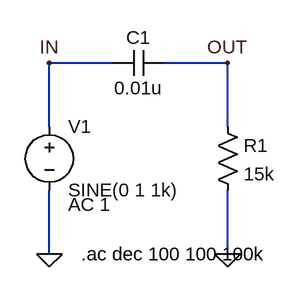
[diagram p0: schematic 2-1-2_RC_HPF.asc]
2-1-2_RC_HPF.asc, the LTspice schematic file:
Version 4.1
SHEET 1 880 680
WIRE 176 48 96 48
WIRE 320 48 240 48
WIRE 96 128 96 48
WIRE 320 128 320 48
WIRE 96 288 96 208
WIRE 320 288 320 208
FLAG 96 288 0
FLAG 320 288 0
FLAG 320 48 OUT
FLAG 96 48 IN
SYMBOL voltage 96 112 R0
WINDOW 123 24 114 Left 2
WINDOW 39 0 0 Left 0
SYMATTR InstName V1
SYMATTR Value SINE(0 1 1k)
SYMATTR Value2 AC 1
SYMBOL cap 240 32 R90
WINDOW 0 0 32 VBottom 2
WINDOW 3 32 32 VTop 2
SYMATTR InstName C1
SYMATTR Value 0.01u
SYMBOL res 304 112 R0
SYMATTR InstName R1
SYMATTR Value 15k
TEXT 136 288 Left 2 !.ac dec 100 100 100k

The netlist it stands for:
* 2-1-2_RC_HPF.asc
V1 IN 0 SINE(0 1 1k) AC 1
C1 OUT IN 0.01u
R1 OUT 0 15k
.ac dec 100 100 100k
.backanno
.end